# EAGLE schematic Battery Board (EAGLE 6.4)
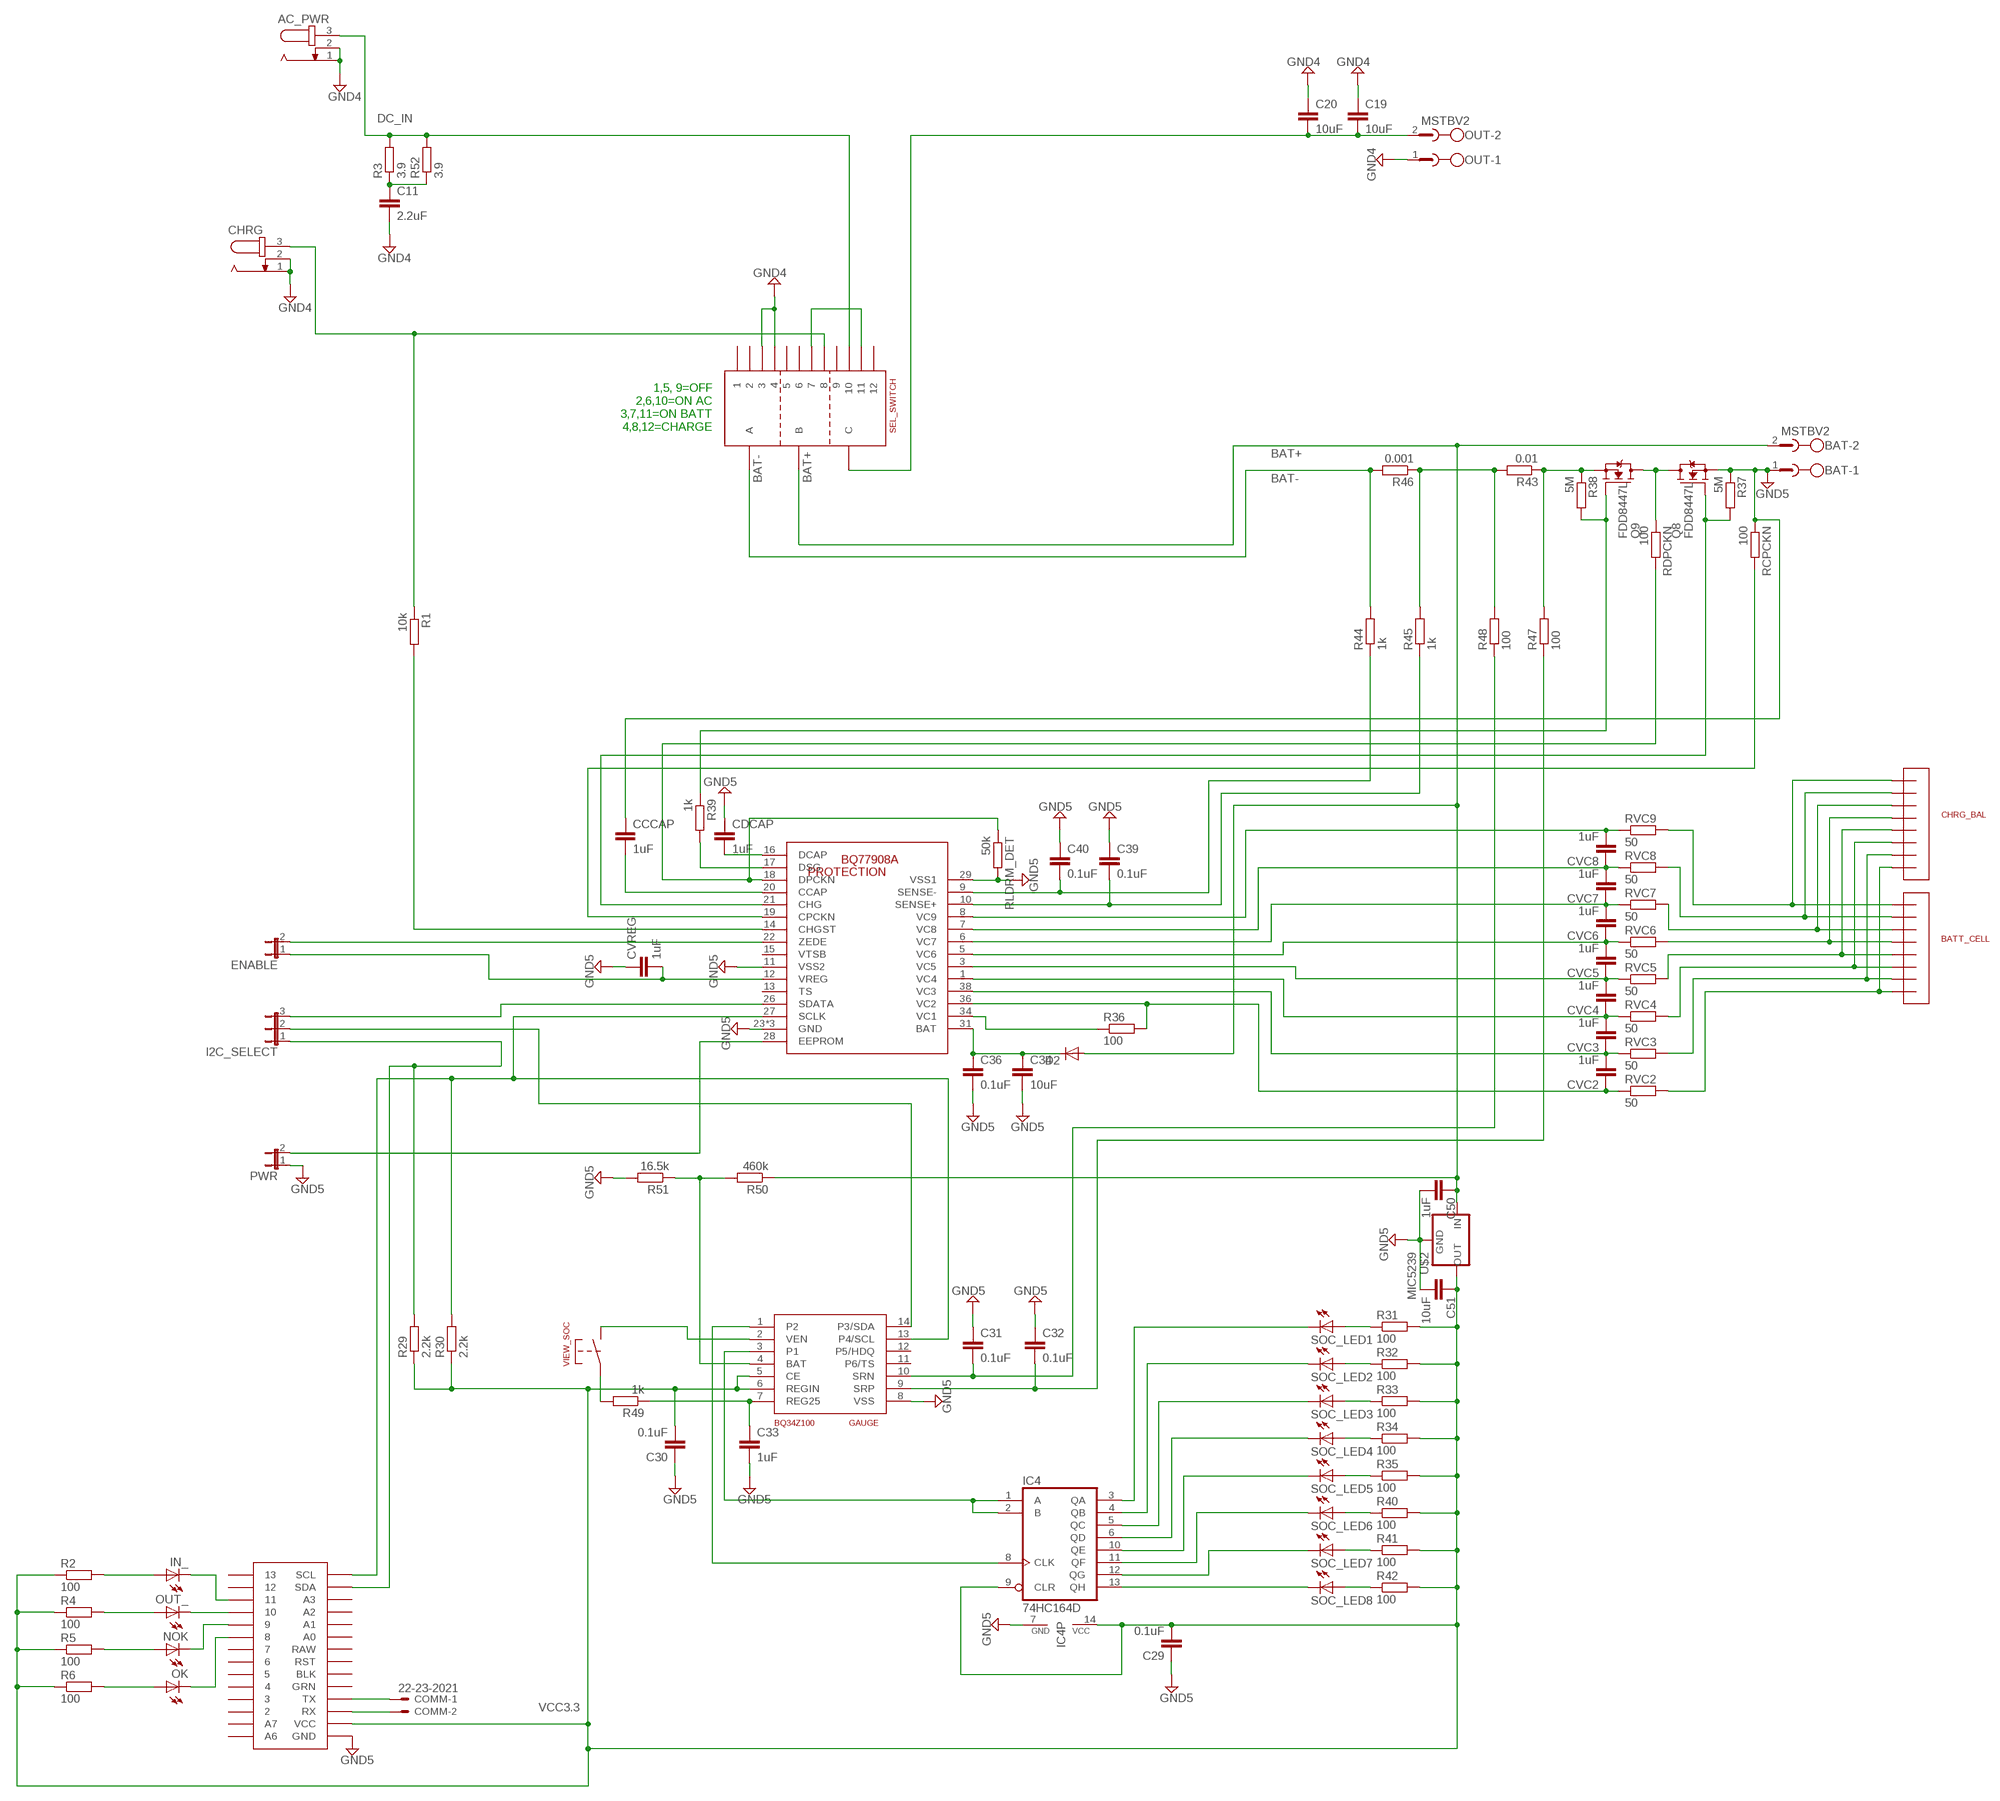
[diagram p0: schematic, sheet 1]

## Parts
AC_PWR  JACK-PLUG1  [SPC4078]
BAT  MSTBV2  [MSTBV2]
BATT_CELL  JST-XH-8  [8PIN-2.5MM]
C11  2.2uF  C-EUC1206  [C1206]
C19  10uF  C-EUC1812  [C1812]
C20  10uF  C-EUC1812  [C1812]
C29  0.1uF  C-EUC0603  [C0603]
C30  0.1uF  C-EUC0603  [C0603]
C31  0.1uF  C-EUC0603  [C0603]
C32  0.1uF  C-EUC0603  [C0603]
C33  1uF  C-EUC0603  [C0603]
C34  10uF  C-EUC1210  [C1210]
C36  0.1uF  C-EUC1210  [C1210]
C39  0.1uF  C-EUC0603  [C0603]
C40  0.1uF  C-EUC0603  [C0603]
C50  1uF  C-EUC0603  [C0603]
C51  10uF  C-EUC0603  [C0603]
CCCAP  1uF  C-EUC1206  [C1206]
CDCAP  1uF  C-EUC1206  [C1206]
CHRG  JACK-PLUG1  [SPC4078]
CHRG_BAL  JST-XH-8  [8PIN-2.5MM]
COMM  22-23-2021  [22-23-2021]
CVC2  1uF  C-EUC0603  [C0603]
CVC3  1uF  C-EUC0603  [C0603]
CVC4  1uF  C-EUC0603  [C0603]
CVC5  1uF  C-EUC0603  [C0603]
CVC6  1uF  C-EUC0603  [C0603]
CVC7  1uF  C-EUC0603  [C0603]
CVC8  1uF  C-EUC0603  [C0603]
CVREG  1uF  C-EUC0603  [C0603]
D2  DIODE-SOD123  [SOD123]
ENABLE  JP1E  [JP1]
GAUGE  BQ34Z100  [TSSOP-14-0.65MM]
I2C_SELECT  JP2E  [JP2]
IC4  74HC164D  [SO14]
IN_  LEDCHIP-LED0603  [CHIP-LED0603]
NOK  LEDCHIP-LED0603  [CHIP-LED0603]
OK  LEDCHIP-LED0603  [CHIP-LED0603]
OUT  MSTBV2  [MSTBV2]
OUT_  LEDCHIP-LED0603  [CHIP-LED0603]
PROTECTION  BQ77908A  [TSSOP-38-0.5MM]
PWR  JP1E  [JP1]
Q8  FDD8447L  [TO252]
Q9  FDD8447L  [TO252]
R1  10k  R-EU_R0603  [R0603]
R2  100  R-EU_R0603  [R0603]
R3  3.9  R-EU_R1206  [R1206]
R4  100  R-EU_R0603  [R0603]
R5  100  R-EU_R0603  [R0603]
R6  100  R-EU_R0603  [R0603]
R29  2.2k  R-EU_R0603  [R0603]
R30  2.2k  R-EU_R0603  [R0603]
R31  100  R-EU_R0603  [R0603]
R32  100  R-EU_R0603  [R0603]
R33  100  R-EU_R0603  [R0603]
R34  100  R-EU_R0603  [R0603]
R35  100  R-EU_R0603  [R0603]
R36  100  R-EU_R0603  [R0603]
R37  5M  R-EU_R0603  [R0603]
R38  5M  R-EU_R0603  [R0603]
R39  1k  R-EU_R0603  [R0603]
R40  100  R-EU_R0603  [R0603]
R41  100  R-EU_R0603  [R0603]
R42  100  R-EU_R0603  [R0603]
R43  0.01  R-EU_R2010  [R2010]
R44  1k  R-EU_R0603  [R0603]
R45  1k  R-EU_R0603  [R0603]
R46  0.001  R-EU_R2010  [R2010]
R47  100  R-EU_R0603  [R0603]
R48  100  R-EU_R0603  [R0603]
R49  1k  R-EU_R0603  [R0603]
R50  460k  R-EU_R0805  [R0805]
R51  16.5k  R-EU_R0603  [R0603]
R52  3.9  R-EU_R1206  [R1206]
RCPCKN  100  R-EU_R0603  [R0603]
RDPCKN  100  R-EU_R0603  [R0603]
RLDRM_DET  50k  R-EU_R0603  [R0603]
RVC2  50  R-EU_R1206  [R1206]
RVC3  50  R-EU_R1206  [R1206]
RVC4  50  R-EU_R1206  [R1206]
RVC5  50  R-EU_R1206  [R1206]
RVC6  50  R-EU_R1206  [R1206]
RVC7  50  R-EU_R1206  [R1206]
RVC8  50  R-EU_R1206  [R1206]
RVC9  50  R-EU_R1206  [R1206]
SEL_SWITCH  CK1026  [CK1026]
SOC_LED1  LEDCHIP-LED0603  [CHIP-LED0603]
SOC_LED2  LEDCHIP-LED0603  [CHIP-LED0603]
SOC_LED3  LEDCHIP-LED0603  [CHIP-LED0603]
SOC_LED4  LEDCHIP-LED0603  [CHIP-LED0603]
SOC_LED5  LEDCHIP-LED0603  [CHIP-LED0603]
SOC_LED6  LEDCHIP-LED0603  [CHIP-LED0603]
SOC_LED7  LEDCHIP-LED0603  [CHIP-LED0603]
SOC_LED8  LEDCHIP-LED0603  [CHIP-LED0603]
U$1  ARDUINO-MINI-PRO  [ARDUINO-MINI-PRO]
U$2  MIC5239  [SOT223]
VIEW_SOC  PUSHBUTTON  [PUSHBUTTON]

## Nets
BAT+: BAT.2 C50.1 D2.A R50.1 SEL_SWITCH.B U$2.1(IN)
BAT-: R44.2 R46.2 SEL_SWITCH.A
DC_IN: AC_PWR.3 R3.2 R52.2 SEL_SWITCH.10
GND4: AC_PWR.1 AC_PWR.2 C11.2 C19.1 C20.1 CHRG.1 CHRG.2 OUT.1 SEL_SWITCH.3 SEL_SWITCH.4
GND5: BAT.1 C29.1 C30.1 C31.1 C32.1 C33.2 C34.2 C36.2 C39.1 C40.1 C50.2 C51.2 CCCAP.1 CDCAP.1 CVREG.1 GAUGE.8(VSS) IC4.7(GND) PROTECTION.11(VSS2) PROTECTION.23(GND) PROTECTION.24(GND) PROTECTION.25(GND) PROTECTION.29(VSS1) PWR.1 Q8.2(S) R37.1 R51.2 RCPCKN.1 RLDRM_DET.2 U$1.GND U$2.2(GND) U$2.4(GND)
N$2: CHRG.3 R1.1 SEL_SWITCH.8
N$3: PROTECTION.14(CHGST) R1.2
N$4: COMM.2 U$1.RXI(RX)
N$5: SEL_SWITCH.7 SEL_SWITCH.11
N$6: COMM.1 U$1.TXO(TX)
N$7: IN_.A R2.2
N$8: IN_.C U$1.11
N$9: OK.A R6.2
N$10: NOK.A R5.2
N$11: OUT_.A R4.2
N$12: OUT_.C U$1.10
N$13: C11.1 R3.1 R52.1
N$14: NOK.C U$1.9
N$15: OK.C U$1.8
N$46: C19.2 C20.2 OUT.2 SEL_SWITCH.C
N$58: Q8.3(D) Q9.3(D) RDPCKN.1
N$61: C32.2 GAUGE.9(SRP) R47.1
N$66: C34.1 C36.1 D2.C PROTECTION.31(BAT)
N$68: BATT_CELL.P$8 CHRG_BAL.P$8 RVC2.2
N$71: CVC8.2 PROTECTION.8(VC9) RVC9.1
N$72: CVC2.1 PROTECTION.36(VC2) R36.2 RVC2.1
N$73: CVC4.2 CVC5.1 PROTECTION.3(VC5) RVC5.1
N$74: CVC2.2 CVC3.1 PROTECTION.38(VC3) RVC3.1
N$75: PROTECTION.34(VC1) R36.1
N$76: CVC6.2 CVC7.1 PROTECTION.6(VC7) RVC7.1
N$77: CVC5.2 CVC6.1 PROTECTION.5(VC6) RVC6.1
N$78: CVC3.2 CVC4.1 PROTECTION.1(VC4) RVC4.1
N$79: BATT_CELL.P$7 CHRG_BAL.P$7 RVC3.2
N$80: BATT_CELL.P$6 CHRG_BAL.P$6 RVC4.2
N$81: BATT_CELL.P$5 CHRG_BAL.P$5 RVC5.2
N$82: BATT_CELL.P$4 CHRG_BAL.P$4 RVC6.2
N$83: BATT_CELL.P$3 CHRG_BAL.P$3 RVC7.2
N$84: BATT_CELL.P$2 CHRG_BAL.P$2 RVC8.2
N$85: BATT_CELL.P$1 CHRG_BAL.P$1 RVC9.2
N$86: C33.1 GAUGE.7(REG25) R49.1
N$87: Q9.1(G) R38.2 R39.1
N$88: PROTECTION.21(CHG) Q8.1(G) R37.2
N$89: PROTECTION.17(DSG) R39.2
N$90: CDCAP.2 PROTECTION.16(DCAP)
N$91: CVC7.2 CVC8.1 PROTECTION.7(VC8) RVC8.1
N$92: PROTECTION.18(DPCKN) RDPCKN.2 RLDRM_DET.1
N$93: R31.1 SOC_LED1.A
N$94: PROTECTION.19(CPCKN) RCPCKN.2
N$95: CCCAP.2 PROTECTION.20(CCAP)
N$96: R32.1 SOC_LED2.A
N$97: C39.2 PROTECTION.10(SENSE+) R45.1
N$99: C40.2 PROTECTION.9(SENSE-) R44.1
N$102: R33.1 SOC_LED3.A
N$103: ENABLE.2 PROTECTION.22(ZEDE)
N$104: PROTECTION.28(EEPROM) PWR.2
N$106: R34.1 SOC_LED4.A
N$107: R35.1 SOC_LED5.A
N$108: R40.1 SOC_LED6.A
N$109: R41.1 SOC_LED7.A
N$110: R42.1 SOC_LED8.A
N$111: IC4.13(QH) SOC_LED8.C
N$112: IC4.3(QA) SOC_LED1.C
N$113: IC4.4(QB) SOC_LED2.C
N$114: IC4.5(QC) SOC_LED3.C
N$115: IC4.6(QD) SOC_LED4.C
N$116: IC4.10(QE) SOC_LED5.C
N$118: IC4.12(QG) SOC_LED7.C
N$120: I2C_SELECT.3 PROTECTION.26(SDATA)
N$121: GAUGE.14(P3/SDA) I2C_SELECT.2
N$122: C31.2 GAUGE.10(SRN) R48.1
N$123: GAUGE.3(P1) IC4.1(A) IC4.2(B)
N$124: GAUGE.1(P2) IC4.8(CLK)
N$126: R49.2 VIEW_SOC.P$1 VIEW_SOC.P$2
N$127: GAUGE.2(VEN) VIEW_SOC.P$3 VIEW_SOC.P$4
N$128: GAUGE.4(BAT) R50.2 R51.1
N$130: CVREG.2 ENABLE.1 PROTECTION.12(VREG)
N$131: R43.2 R45.2 R46.1 R48.2
N$132: Q9.2(S) R38.1 R43.1 R47.2
SCL: GAUGE.13(P4/SCL) PROTECTION.27(SCLK) R30.2 U$1.A5(SCL)
SDA: I2C_SELECT.1 R29.2 U$1.A4(SDA)
SOC_LED6: IC4.11(QF) SOC_LED6.C
VCC3.3: C29.2 C30.2 C51.1 GAUGE.5(CE) GAUGE.6(REGIN) IC4.9(CLR) IC4.14(VCC) R2.1 R4.1 R5.1 R6.1 R29.1 R30.1 R31.2 R32.2 R33.2 R34.2 R35.2 R40.2 R41.2 R42.2 U$1.VCC U$2.3(OUT)
Unconnected: GAUGE.11(P6/TS) GAUGE.12(P5/HDQ) PROTECTION.13(TS) PROTECTION.15(VTSB) SEL_SWITCH.1 SEL_SWITCH.2 SEL_SWITCH.5 SEL_SWITCH.6 SEL_SWITCH.9 SEL_SWITCH.12 U$1.2 U$1.3 U$1.4 U$1.5 U$1.6 U$1.7 U$1.12 U$1.13 U$1.A0 U$1.A1 U$1.A2 U$1.A3 U$1.A6 U$1.A7 U$1.BLK U$1.GRN U$1.RAW U$1.RST

## Notes on the sheet
- 1,5, 9=OFF
  2,6,10=ON AC
  3,7,11=ON BATT
  4,8,12=CHARGE

## Library data of the parts
AC_PWR CHRG = con-jack:JACK-PLUG: DC POWER JACK Power Jack, DC, Right Angle, Through Hole, Rated 5A at 16VDC, PC Terminals Distributor: Farnell (www.Farnell.de) Drawing: 84N1161.pdf / 84N1162.pdf Manufacturer: SPC Technology (www.spctechnology.com) Type: SPC4077 / SPC 4078; OC_FARNELL: unknown; OC_NEWARK: unknown
BAT OUT = con-phoenix-508:MSTBV2: PHOENIX; MPN: MSTBV 2,5/2-GF-5.08; OC_FARNELL: 1792792; OC_NEWARK: 69R9845
BATT_CELL CHRG_BAL = custom:JST-XH-8
C11 C19 C20 C29-C34 C36 C39 C40 C50 C51 CCCAP CDCAP CVC2-CVC8 CVREG = rcl:C-EU: CAPACITOR, European symbol
COMM = con-molex:22-23-2021: .100" (2.54mm) Center Header - 2 Pin; MF: MOLEX; MPN: 22-23-2021; OC_FARNELL: 1462926; OC_NEWARK: 25C3832
D2 = diode:DIODE-: DIODE
ENABLE PWR = jumper:JP1E: JUMPER
GAUGE = custom:BQ34Z100
I2C_SELECT = jumper:JP2E: JUMPER
IC4 = 74xx-eu:74*164: 8-bit parallel out SHIFT REGISTER
IN_ NOK OK OUT_ SOC_LED1-SOC_LED8 = led:LED: LED OSRAM: - CHIPLED LG R971, LG N971, LY N971, LG Q971, LY Q971, LO R971, LY R971 LH N974, LH R974 LS Q976, LO Q976, LY Q976 LO Q996 - Hyper CHIPLED LW Q18S LB Q993, LB Q99A, LB R99A - SideLED LS A670, LO A670, LY A670, LG A670, LP A670 LB A673, LV A673, LT A673, LW A673 LH A674 LY A675 LS A676, LA A676, LO A676, LY A676, LW A676 LS A679, LY A679, LG A679 - Hyper Micro SIDELED® LS Y876, LA Y876, LO Y876, LY Y876 LT Y87S - SmartLED LW L88C, LW L88S LB L89C, LB L89S, LG L890 LS L89K, LO L89K, LY L89K LS L896, LA L896, LO L896, LY L896 - TOPLED LS T670, LO T670, LY T670, LG T670, LP T670 LSG T670, LSP T670, LSY T670, LOP T670, LYG T670 LG T671, LOG T671, LSG T671 LB T673, LV T673, LT T673, LW T673 LH T674 LS T676, LA T676, LO T676, LY T676, LB T676, LH T676, LSB T676, LW T676 LB T67C, LV T67C, LT T67C, LS T67K, LO T67K, LY T67K, LW E67C LS E67B, LA E67B, LO E67B, LY E67B, LB E67C, LV E67C, LT E67C LW T67C LS T679, LY T679, LG T679 LS T770, LO T770, LY T770, LG T770, LP T770 LB T773, LV T773, LT T773, LW T773 LH T774 LS E675, LA E675, LY E675, LS T675 LS T776, LA T776, LO T776, LY T776, LB T776 LHGB T686 LT T68C, LB T68C - Hyper Mini TOPLED® LB M676 - Mini TOPLED Santana® LG M470 LS M47K, LO M47K, LY M47K Source: http://www.osram.convergy.de LUXEON: - LUMILED® LXK2-PW12-R00, LXK2-PW12-S00, LXK2-PW14-U00, LXK2-PW14-V00 LXK2-PM12-R00, LXK2-PM12-S00, LXK2-PM14-U00 LXK2-PE12-Q00, LXK2-PE12-R00, LXK2-PE12-S00, LXK2-PE14-T00, LXK2-PE14-U00 LXK2-PB12-K00, LXK2-PB12-L00, LXK2-PB12-M00, LXK2-PB14-N00, LXK2-PB14-P00, LXK2-PB14-Q00 LXK2-PR12-L00, LXK2-PR12-M00, LXK2-PR14-Q00, LXK2-PR14-R00 LXK2-PD12-Q00, LXK2-PD12-R00, LXK2-PD12-S00 LXK2-PH12-R00, LXK2-PH12-S00 LXK2-PL12-P00, LXK2-PL12-Q00, LXK2-PL12-R00 Source: www.luxeon.com KINGBRIGHT: KA-3528ASYC Source: www.kingbright.com
PROTECTION = custom:BQ77908A
Q8 Q9 = transistor-fet:FDD8447L
R1-R6 R29-R52 RCPCKN RDPCKN RLDRM_DET RVC2-RVC9 = rcl:R-EU_: RESISTOR, European symbol
SEL_SWITCH = custom:CK1026: 3 Poles 4 Ways Rotary switch
U$1 = custom:ARDUINO-MINI-PRO
U$2 = v-reg:MIC5239
VIEW_SOC = custom:PUSHBUTTON